# EAGLE design Schematic_motor_driver (EAGLE 7.2.0)
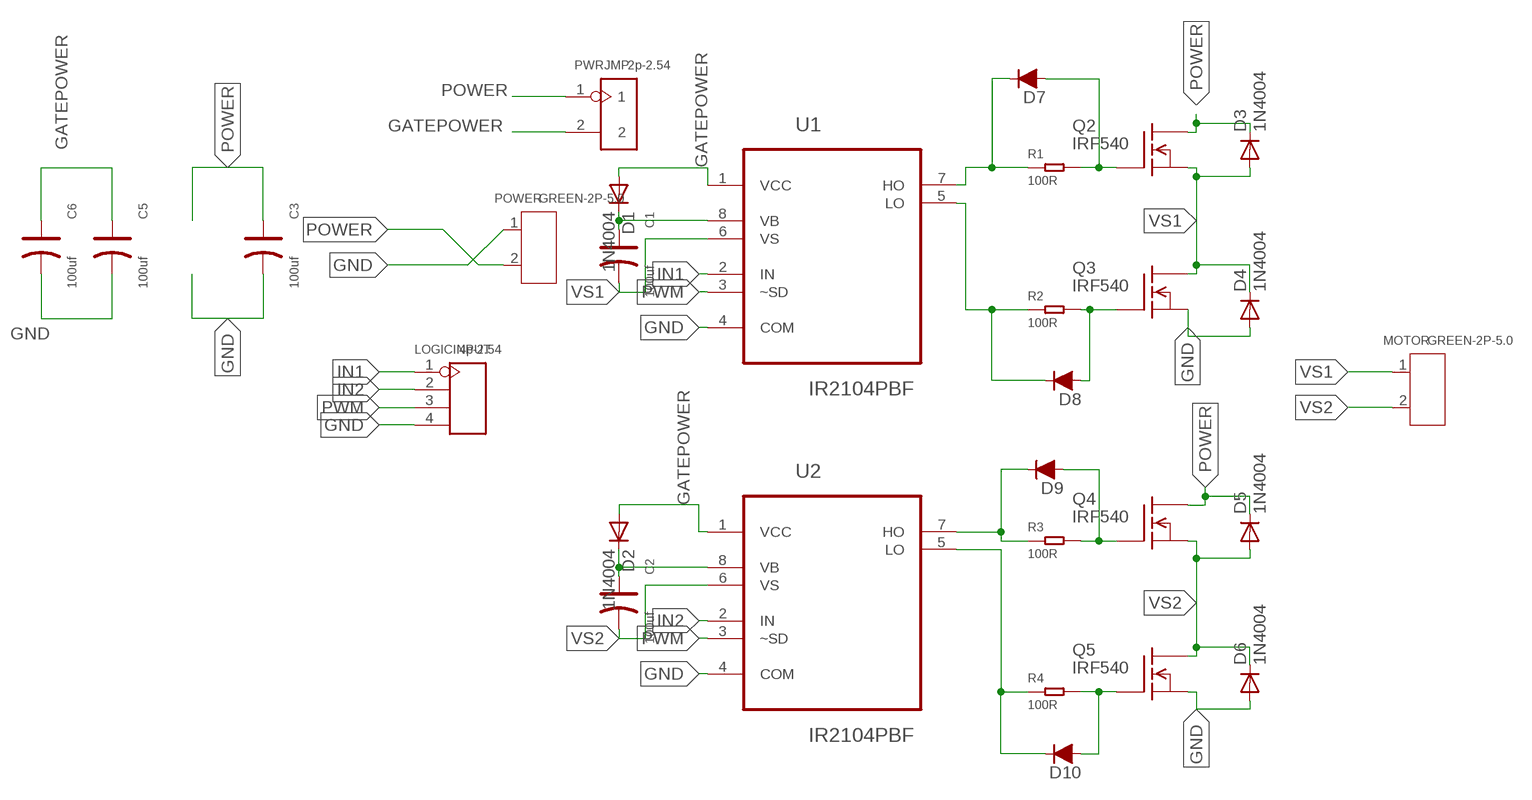
[diagram p0: schematic, sheet 1]

## Parts
C1  100uf  DIP-ALUMINUM-100UF-16V(D5-H7MM)  [PC-D5.3MM]
C2  100uf  DIP-ALUMINUM-100UF-16V(D5-H7MM)  [PC-D5.3MM]
C3  100uf  DIP-ALUMINUM-100UF-16V(D5-H7MM)  [PC-D5.3MM]
C5  100uf  DIP-ALUMINUM-100UF-16V(D5-H7MM)  [PC-D5.3MM]
C6  100uf  DIP-ALUMINUM-100UF-16V(D5-H7MM)  [PC-D5.3MM]
D1  1N4004  [DO41-10]
D2  1N4004  [DO41-10]
D3  1N4004  [DO41-10]
D4  1N4004  [DO41-10]
D5  1N4004  [DO41-10]
D6  1N4004  [DO41-10]
D7  D-FILL-MLL-41  [MELF-MLL41]
D8  D-FILL-MLL-41  [MELF-MLL41]
D9  D-FILL-MLL-41  [MELF-MLL41]
D10  D-FILL-MLL-41  [MELF-MLL41]
LOGICINPUT  4p-2.54  DIP-BLACK-FEMALE-HEADER-VERT(4P-2.54)  [H4-2.54]
MOTOR  GREEN-2P-5.0  SCREW-TERMINAL-GREEN(2P-5.0)  [H2-5.0-10.5X8.0MM]
POWER  GREEN-2P-5.0  SCREW-TERMINAL-GREEN(2P-5.0)  [H2-5.0-10.5X8.0MM]
PWRJMP  2p-2.54  DIP-BLACK-MALE-HEADER-VERT(2P-2.54)  [H2-2.54]
Q2  IRF540  [TO220]
Q3  IRF540  [TO220]
Q4  IRF540  [TO220]
Q5  IRF540  [TO220]
R1  100R  SMD-RES-100R-5%-1/4W(1206)  [R1206]
R2  100R  SMD-RES-100R-5%-1/4W(1206)  [R1206]
R3  100R  SMD-RES-100R-5%-1/4W(1206)  [R1206]
R4  100R  SMD-RES-100R-5%-1/4W(1206)  [R1206]
U1  IR2104PBF  [DIP254P762X533-8]
U2  IR2104PBF  [DIP254P762X533-8]

## Nets
GATEPOWER: C5.+ C6.+ D1.A D2.A PWRJMP.2 U1.1(VCC) U2.1(VCC)
GND: C3.- C5.- C6.- D4.A D6.A LOGICINPUT.4 POWER.1 Q3.3(S) Q5.3(S) U1.4(COM) U2.4(COM)
IN1: LOGICINPUT.1 U1.2(IN)
IN2: LOGICINPUT.2 U2.2(IN)
N$1: D8.2(A) Q3.1(G) R2.2
N$2: C1.+ D1.C U1.8(VB)
N$3: D9.2(A) Q4.1(G) R3.2
N$4: C2.+ D2.C U2.8(VB)
N$5: D10.2(A) Q5.1(G) R4.2
N$6: D7.2(A) Q2.1(G) R1.2
N$7: D7.1(C) R1.1 U1.7(HO)
N$8: D8.1(C) R2.1 U1.5(LO)
N$9: D9.1(C) R3.1 U2.7(HO)
N$10: D10.1(C) R4.1 U2.5(LO)
POWER: C3.+ D3.C D5.C POWER.2 PWRJMP.1 Q2.2(D) Q4.2(D)
PWM: LOGICINPUT.3 U1.3(~SD) U2.3(~SD)
VS1: C1.- D3.A D4.C MOTOR.1 Q2.3(S) Q3.2(D) U1.6(VS)
VS2: C2.- D5.A D6.C MOTOR.2 Q4.3(S) Q5.2(D) U2.6(VS)

## Library data of the parts
C1-C3 C5 C6 = Seeed-Capacitor-2016:DIP-ALUMINUM-100UF-16V(D5-H7MM): 302030031; MPN: KS 100uF/16V
D1-D6 = adafruit:1N4004: DIODE General purpose 1N400x type rectifier (With bigger pads) http://www.ladyada.net/library/pcb/eaglelibrary.html
D7-D10 = semicon-smd-ipc:D-FILL-: DIODE filled
LOGICINPUT = Seeed-Connector -2016:DIP-BLACK-FEMALE-HEADER-VERT(4P-2.54): 320030017; MPN: F185-1104A1BSYA1
MOTOR POWER = Seeed-Connector -2016:SCREW-TERMINAL-GREEN(2P-5.0): 320110031
PWRJMP = Seeed-OPL-Connector:DIP-BLACK-MALE-HEADER-VERT(2P-2.54): 320020016; MPN: P125-1102A0BS116A1
Q2-Q5 = transistor-fet:IRF540: N-Channel Enhancement MOSFET (HEXFET); 100V; 28A; 0,077Ohm
R1-R4 = Seeed-Resistor-2016:SMD-RES-100R-5%-1/4W(1206): 301010412; MPN: RC1206JR-07100RL
U1 U2 = International_Rectifier_By_element14_Batch_1:IR2104PBF: HALF BRIDGE DRIVER; MPN: IR2104PBF; OC_FARNELL: 8638748; OC_NEWARK: 63J7843; PACKAGE: PDIP; SUPPLIER: INTERNATIONAL RECTIFIER

## Board
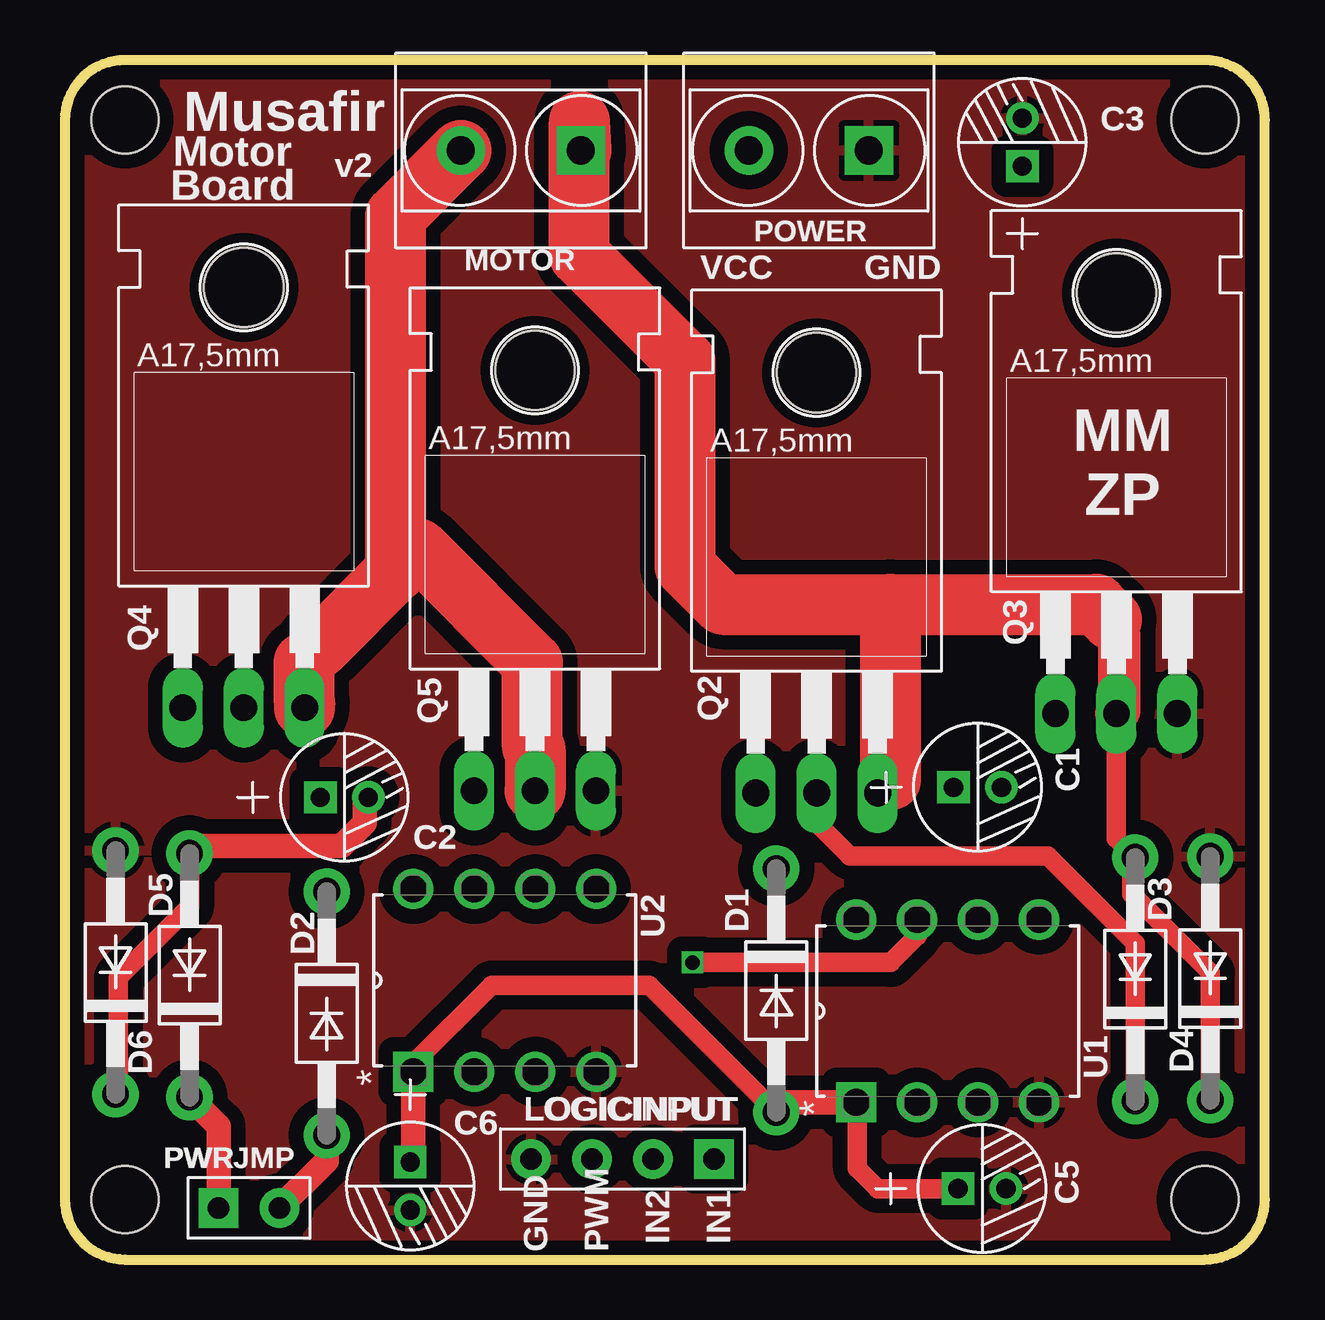
[diagram p1: board, top side]
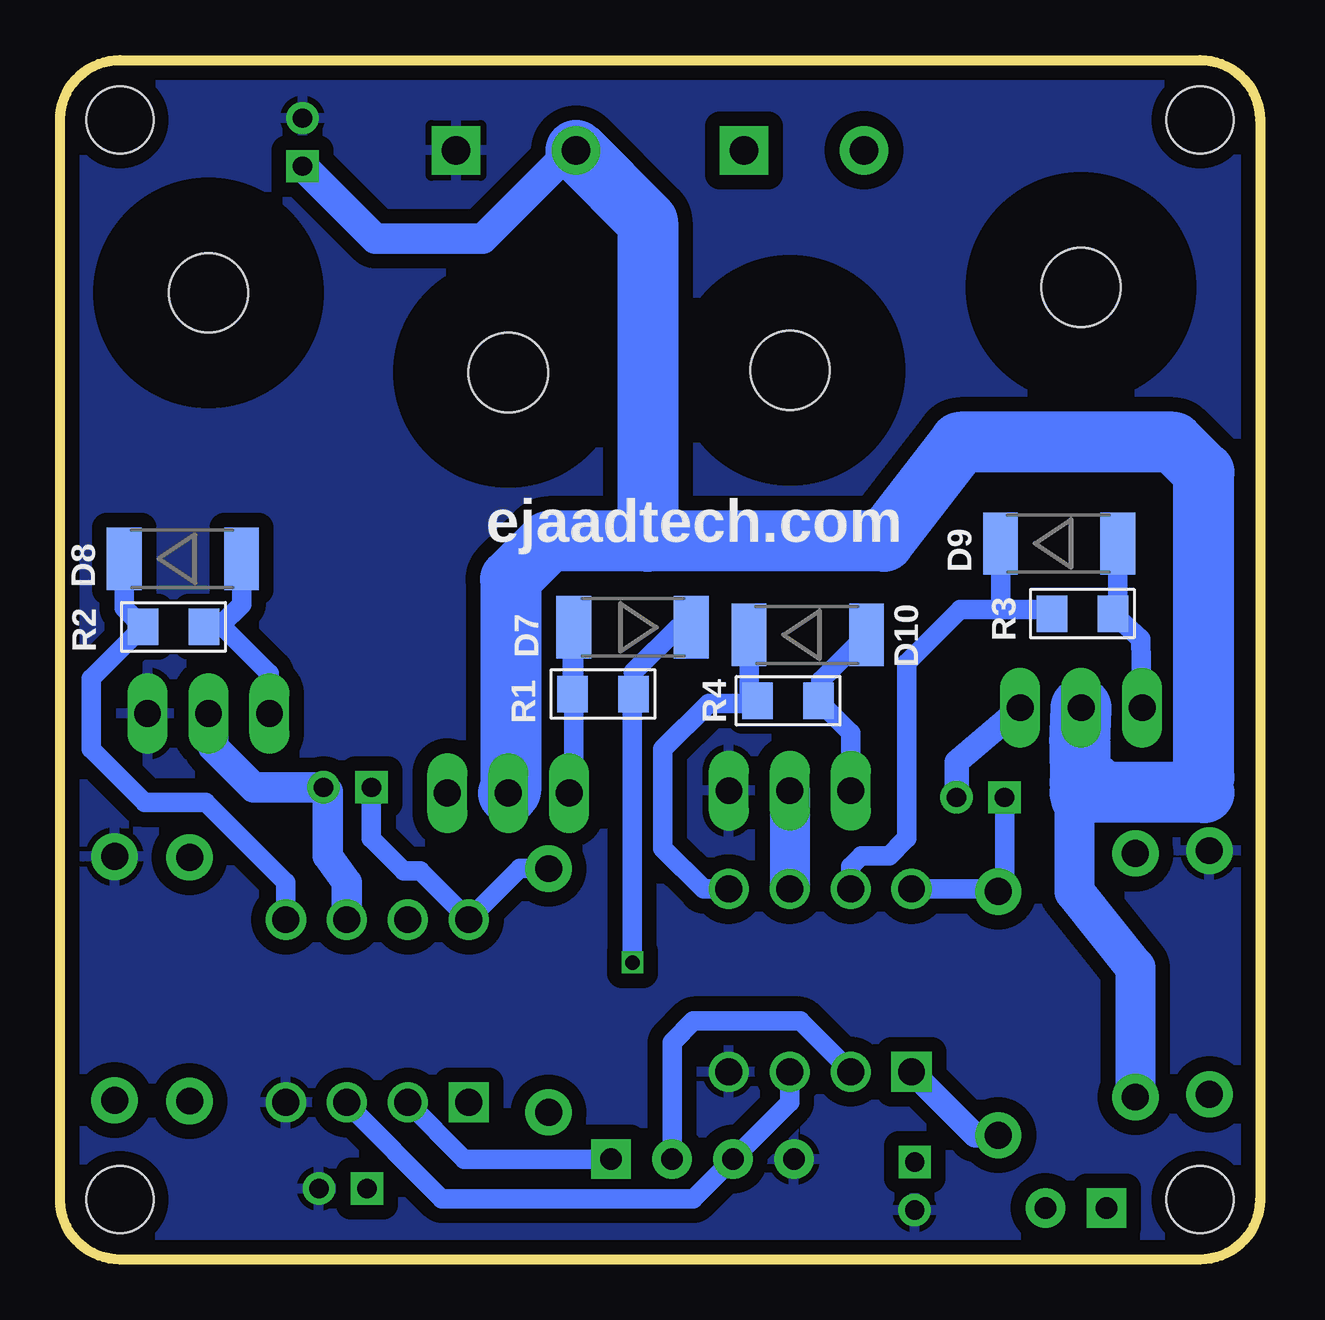
[diagram p2: board, bottom side, seen from below]

Size 50 x 50 mm. Coordinates in mm from the lower left corner, seen from the top.
Outline: 47.5,50 2.5,50 arc90 0,47.5 0,2.5 arc90 2.5,0 47.5,0 arc90 50,2.5 50,47.5 arc90 47.5,50
Copper layers (1*16): Top 0.035mm / dielectric 1.6mm / Bottom 0.035mm
Design rules "Elecrow_2-layer_PCB_eagle_rule": minimum track width 6mil, minimum drill 12mil, track to track 6mil, track to pad 6mil, pad to pad 6mil, via to via 8mil, smd to smd 0mil, copper to edge 20mil, drill to drill 10mil, minimum pad ring 6mil, minimum via ring 6mil, stop-mask expansion 0mil, vias tented up to drill 100mil, thermal gap 10mil
Holes 2.8 mm at 2.5,2.5 47.5,2.5 2.5,47.5 47.5,47.5

### Footprints (pad centres in the part's own frame; a part is rotated, then mirrored left to right if it is on the bottom)
PC-D5.3MM = drill 0.8 pad 1.35 square: + -1,0 | drill 0.8 pad 1.35: - 1,0
DO41-10 = drill 1.118 pad 1.93: A 5.08,0; C -5.08,0
MELF-MLL41 = smd 1.45 x 2.6: 1 -2.445,0; 2 2.445,0
H4-2.54 = drill 0.889 pad 1.651 square: 1 0,3.81 | drill 0.889 pad 1.651: 2 0,1.27; 3 0,-1.27; 4 0,-3.81
H2-5.0-10.5X8.0MM = drill 1.168 pad 2.032 square: 1 0,2.5 | drill 1.168 pad 2.032: 2 0,-2.5
H2-2.54 = drill 0.889 pad 1.651 square: 1 0,1.27 | drill 0.889 pad 1.651: 2 0,-1.27
TO220 = drill 1.118 long: 1 -2.54,-6.35; 2 0,-6.35; 3 2.54,-6.35 | hole 3.302: 0,11.176
R1206 = smd 1.27 x 1.524: 1 -1.27,0; 2 1.27,0
DIP254P762X533-8 = drill 1.118 square: 1 -7.62,7.62 | drill 1.118: 2 -7.62,5.08; 3 -7.62,2.54; 4 -7.62,0; 5 0,0; 6 0,2.54; 7 0,5.08; 8 0,7.62

### Placement (x,y rotation side)
C1  38.02,19.68 0 top
C2  11.64,19.26 0 top
C3  39.89,46.57 90 top
C5  38.21,2.96 0 top
C6  14.39,3.06 270 top
D1  29.64,11.21 270 top
D2  10.91,10.26 270 top
D3  44.6,11.68 90 top
D4  47.72,11.72 90 top
D5  5.19,11.85 90 top
D6  2.11,11.96 90 top
D7  26.15,26.35 180 bottom
D8  44.88,29.21 0 bottom
D9  8.37,29.84 0 bottom
D10  18.84,26.04 0 bottom
LOGICINPUT  23.23,4.19 270 top
MOTOR  19,46.23 270 top
POWER  31,46.23 270 top
PWRJMP  7.67,2.15 90 top
Q2  31.32,25.79 0 top
Q3  43.81,29.11 0 top
Q4  7.45,29.35 0 top
Q5  19.59,25.89 0 top
R1  27.38,23.57 180 bottom
R2  45.27,26.37 0 bottom
R3  7.4,26.93 0 bottom
R4  19.66,23.29 0 bottom
U1  40.59,14.17 90 top
U2  22.14,15.45 90 top

### Tracks (layer width: path | path; a pad name or v marks a point on that pad's centre or on a via)
GATEPOWER
  Top 0.813: D1.A 24.34,11.43 17.78,11.43 14.52,8.17 U2.1 | C5.+ 33.87,2.96 33.02,3.81 33.02,6.5 U1.1
  Top 1.016: U1.1 30.05,6.55 D1.A | PWRJMP.2 10.91,4.12 D2.A | C6.+ 14.52,4.19 U2.1
  Bottom 1.016: U2.1 11.87,5.18 D2.A
GND
  pour Bottom (isolate 0.61): -29,73 76,73 76,-14 -29,-14
  pour Top (isolate 0.61): 69.64,76.81 -35.36,76.81 -35.36,-10.19 69.64,-10.19
IN1
  Bottom 0.813: LOGICINPUT.1 33.15,4.19 U1.2
IN2
  Bottom 0.305: U2.2
  Bottom 0.813: U2.2 19.16,9.94 23.61,9.94 24.5,9.05 LOGICINPUT.2
N$1
  Bottom 0.406: 43.29,26.45 43.98,26.45 R2.2
  Bottom 0.813: Q3.1 41.27,24.43 43.29,26.45 42.44,27.31 D8.2
N$2
  Bottom 0.813: D1.C 30.84,16.29 U1.8 34.99,16.19 35.67,16.19 37.02,17.55 C1.+
N$3
  Bottom 0.305: 5.92,27.23 R3.2
  Bottom 0.813: Q4.1 4.96,25.86 R3.2 | D9.2 5.92,27.23
N$4
  Bottom 0.406: 10.64,15.39 D2.C
  Bottom 0.813: U2.8 11.33,15.45 D2.C | C2.+ 10.64,15.39
N$5
  Bottom 0.305: 18.3,23.48 R4.2
  Bottom 0.813: Q5.1 17.05,21.95 R4.2 | 18.3,23.48 18.3,24.13 D10.2
N$6
  Bottom 0.813: Q2.1 28.59,19.63 D7.2 28.65,26.3 R1.2
N$7  (via drill 0.6)
  Top 0.813: U1.7 35.51,13.49 34.4,12.38 v26.15,12.38
  Bottom 0.406: 26.15,23.53 R1.1 26.11,24.49 | 24.24,26.35 D7.1
  Bottom 0.813: v26.15,12.38 26.15,23.53 | 26.11,24.49 24.24,26.35
N$8
  Bottom 0.813: U1.5 40.59,15.71 43.93,19.05 46.47,19.05 48.69,21.27 48.69,24.22 R2.1 47.33,27.15 D8.1
N$9
  Bottom 0.406: 8.73,27.09 R3.1 | 10.81,27.18 10.91,27.09 | 14.82,17.46 14.72,17.56
  Bottom 0.813: 14.72,17.56 14.72,24.86 12.49,27.09 10.91,27.09 8.73,27.09 | D9.1 10.81,27.18 | 17.06,15.22 U2.7 17.06,16.39 16.62,16.83 15.45,16.83 14.82,17.46
N$10
  Bottom 0.813: U2.5 23.18,15.45 24.88,17.14 24.88,21.27 22.97,23.18 21.05,23.18 R4.1 21.29,23.65 D10.1
POWER
  Top 0.813: D3.C 44.6,13.19 40.96,16.83 32.7,16.83 31.43,18.1 31.43,19.33 Q2.2
  Top 1.016: D5.C 6.4,5.56 PWRJMP.1
  Bottom 1.27: POWER.2 28.7,46.23 32.38,42.55 36.87,42.55 C3.+
  Bottom 1.676: 7.73,19.15 7.73,15.34 5.19,12.16 D5.C
  Bottom 1.778: 2.33,20.1 2.33,19.47 | 7.5,19.47 7.5,19.9
  Bottom 1.93: 7.5,19.9 6.78,20.1 7.73,19.15
  Bottom 2.54: 7.5,19.9 7.5,21.46 Q4.2 | 2.33,20.1 2.33,32.8 3.6,34.07 12.49,34.07 15.67,29.95 25.51,29.95 | 25.51,29.95 29.64,29.95 31.23,28.36 31.23,19.54 Q2.2 | 2.33,19.47 7.5,19.47 | 25.51,29.95 25.51,43.24 POWER.2
PWM
  Bottom 0.813: U2.3 19.6,6.55 LOGICINPUT.3 23.61,2.54 34.09,2.54 38.05,6.5 U1.3
VS1
  Top 0.813: 44.69,16.86 D3.A | D4.C 47.72,11.97 44.45,15.24 44.45,16.61 D3.A | D3.A 43.81,17.55 Q3.2
  Top 1.676: Q2.3 33.86,19.46 34.4,20
  Top 1.778: 43.61,26.67 43.61,26.35 43.93,26.04 43.93,22.88 Q3.2
  Top 2.54: 34.4,27.3 27.42,27.3 25.83,28.89 25.83,37.47 21.43,41.86 21.43,47.44 MOTOR.1 | 34.4,27.3 42.98,27.3 43.61,26.67 | 34.4,20 34.4,27.3
  Bottom 1.27: Q3.2 43.61,22.56 43.61,21.37 41.92,19.68 C1.- 38.85,19.5 38.85,16.83 38.05,15.71 U1.6
VS2
  Top 0.813: D5.A 5.19,14.72 2.22,11.75 2.22,7 D6.C
  Top 1.016: C2.- 12.49,19.11 12.49,18.2 11.54,17.25 5.51,17.25 arc90 D5.A
  Top 1.93: 10.59,25.5 9.96,24.86 | 19.59,21.27 19.48,21.37
  Top 2.54: 13.77,29.95 13.77,43.49 MOTOR.2 | 13.77,29.95 13.77,28.68 10.59,25.5 | 19.48,21.37 19.48,24.86 14.72,29.63 14.08,29.63 13.77,29.95 | 9.96,24.86 9.96,23.43 Q4.3 | 19.59,21.27 Q5.2
  Bottom 0.305: 19.59,15.46 U2.6
  Bottom 1.016: C2.- 12.64,20.75 Q4.3
  Bottom 1.676: Q5.2 19.59,15.46

### Text on the board
_tNames: Musafir | C3 | Motor / Board | v2 | POWER | MOTOR | VCC | GND | MM / ZP | Q4 | Q3 | Q2 | Q5 | C1 | C2 | D2 | D1 | D5 | D3 | U2 | D6 | U1 | D4 | LOGICINPUT | PWRJMP | C6 | C5 | IN2 | IN1 | GND | PWM
_bNames: ejaadtech.com | D9 | D8 | R3 | D10 | D7 | R2 | R1 | R4